# EAGLE design daughter_brd (EAGLE 5.11)
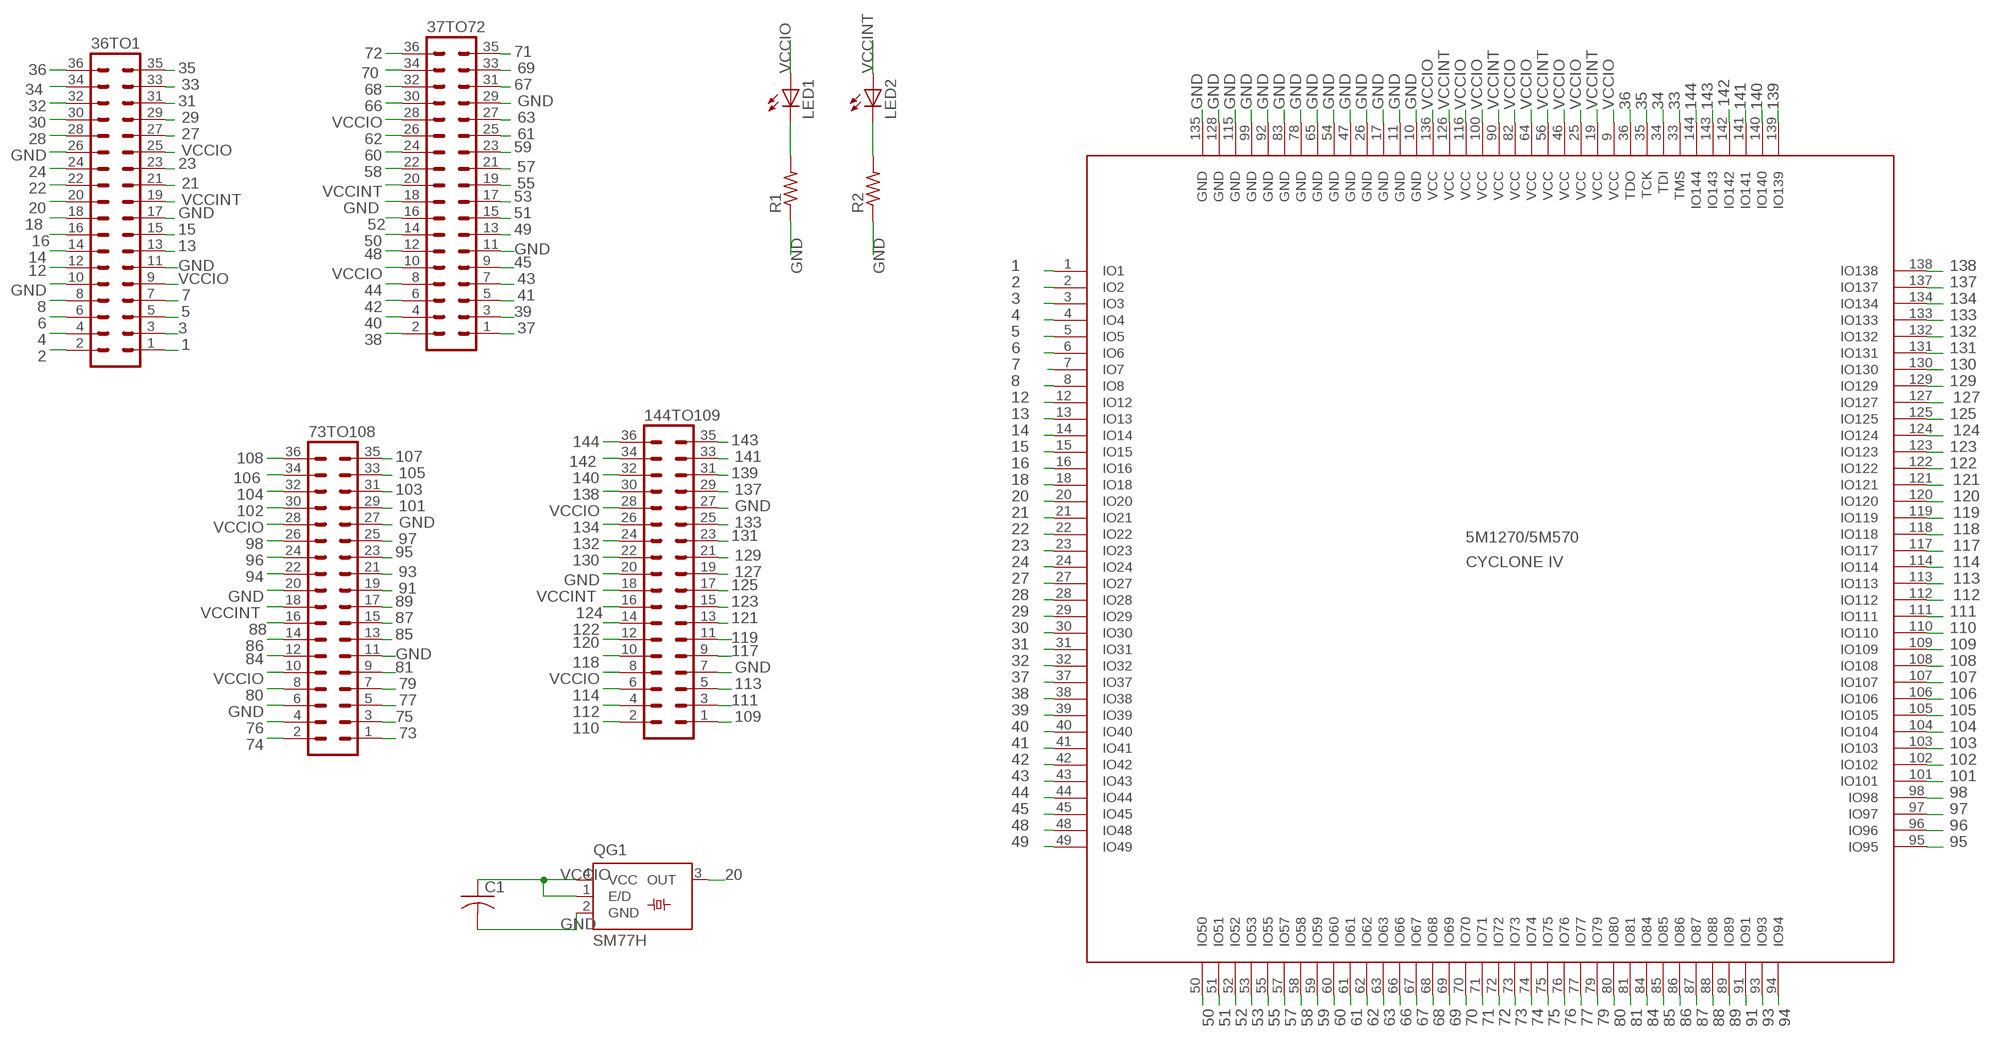
[diagram p0: schematic, sheet 1]

## Parts
5M1270/5M570  CYCLONE IV  IS  [TQFP144]
36TO1  MA18-2  [MA18-2]
37TO72  MA18-2  [MA18-2]
73TO108  MA18-2  [MA18-2]
144TO109  MA18-2  [MA18-2]
C1  C-USC1206  [C1206]
LED1  LEDSMT1206  [1206]
LED2  LEDSMT1206  [1206]
QG1  SM77H  [SM77H]
R1  R-US_M1206  [M1206]
R2  R-US_M1206  [M1206]

## Nets
1: 5M1270/5M570.1(IO1) 36TO1.1
2: 5M1270/5M570.2(IO2) 36TO1.2
3: 5M1270/5M570.3(IO3) 36TO1.3
4: 5M1270/5M570.4(IO4) 36TO1.4
5: 5M1270/5M570.5(IO5) 36TO1.5
6: 5M1270/5M570.6(IO6) 36TO1.6
7: 5M1270/5M570.7(IO7) 36TO1.7
8: 5M1270/5M570.8(IO8) 36TO1.8
12: 5M1270/5M570.12(IO12) 36TO1.12
13: 5M1270/5M570.13(IO13) 36TO1.13
14: 5M1270/5M570.14(IO14) 36TO1.14
15: 5M1270/5M570.15(IO15) 36TO1.15
16: 5M1270/5M570.16(IO16) 36TO1.16
18: 5M1270/5M570.18(IO18) 36TO1.18
20: 5M1270/5M570.20(IO20) 36TO1.20 QG1.3(OUT)
21: 5M1270/5M570.21(IO21) 36TO1.21
22: 5M1270/5M570.22(IO22) 36TO1.22
23: 5M1270/5M570.23(IO23) 36TO1.23
24: 5M1270/5M570.24(IO24) 36TO1.24
27: 5M1270/5M570.27(IO27) 36TO1.27
28: 5M1270/5M570.28(IO28) 36TO1.28
29: 5M1270/5M570.29(IO29) 36TO1.29
30: 5M1270/5M570.30(IO30) 36TO1.30
31: 5M1270/5M570.31(IO31) 36TO1.31
32: 5M1270/5M570.32(IO32) 36TO1.32
33: 5M1270/5M570.33(TMS) 36TO1.33
34: 5M1270/5M570.34(TDI) 36TO1.34
35: 5M1270/5M570.35(TCK) 36TO1.35
36: 5M1270/5M570.36(TDO) 36TO1.36
37: 5M1270/5M570.37(IO37) 37TO72.1
38: 5M1270/5M570.38(IO38) 37TO72.2
39: 5M1270/5M570.39(IO39) 37TO72.3
40: 5M1270/5M570.40(IO40) 37TO72.4
41: 5M1270/5M570.41(IO41) 37TO72.5
42: 5M1270/5M570.42(IO42) 37TO72.6
43: 5M1270/5M570.43(IO43) 37TO72.7
44: 5M1270/5M570.44(IO44) 37TO72.8
45: 5M1270/5M570.45(IO45) 37TO72.9
48: 5M1270/5M570.48(IO48) 37TO72.12
49: 5M1270/5M570.49(IO49) 37TO72.13
50: 5M1270/5M570.50(IO50) 37TO72.14
51: 5M1270/5M570.51(IO51) 37TO72.15
52: 5M1270/5M570.52(IO52) 37TO72.16
53: 5M1270/5M570.53(IO53) 37TO72.17
55: 5M1270/5M570.55(IO55) 37TO72.19
57: 5M1270/5M570.57(IO57) 37TO72.21
58: 5M1270/5M570.58(IO58) 37TO72.22
59: 5M1270/5M570.59(IO59) 37TO72.23
60: 5M1270/5M570.60(IO60) 37TO72.24
61: 5M1270/5M570.61(IO61) 37TO72.25
62: 5M1270/5M570.62(IO62) 37TO72.26
63: 5M1270/5M570.63(IO63) 37TO72.27
66: 5M1270/5M570.66(IO66) 37TO72.30
67: 5M1270/5M570.67(IO67) 37TO72.31
68: 5M1270/5M570.68(IO68) 37TO72.32
69: 5M1270/5M570.69(IO69) 37TO72.33
70: 5M1270/5M570.70(IO70) 37TO72.34
71: 5M1270/5M570.71(IO71) 37TO72.35
72: 5M1270/5M570.72(IO72) 37TO72.36
73: 5M1270/5M570.73(IO73) 73TO108.1
74: 5M1270/5M570.74(IO74) 73TO108.2
75: 5M1270/5M570.75(IO75) 73TO108.3
76: 5M1270/5M570.76(IO76) 73TO108.4
77: 5M1270/5M570.77(IO77) 73TO108.5
79: 5M1270/5M570.79(IO79) 73TO108.7
80: 5M1270/5M570.80(IO80) 73TO108.8
81: 5M1270/5M570.81(IO81) 73TO108.9
84: 5M1270/5M570.84(IO84) 73TO108.12
85: 5M1270/5M570.85(IO85) 73TO108.13
86: 5M1270/5M570.86(IO86) 73TO108.14
87: 5M1270/5M570.87(IO87) 73TO108.15
88: 5M1270/5M570.88(IO88) 73TO108.16
89: 5M1270/5M570.89(IO89) 73TO108.17
91: 5M1270/5M570.91(IO91) 73TO108.19
93: 5M1270/5M570.93(IO93) 73TO108.21
94: 5M1270/5M570.94(IO94) 73TO108.22
95: 5M1270/5M570.95(IO95) 73TO108.23
96: 5M1270/5M570.96(IO96) 73TO108.24
97: 5M1270/5M570.97(IO97) 73TO108.25
98: 5M1270/5M570.98(IO98) 73TO108.26
101: 5M1270/5M570.101(IO101) 73TO108.29
102: 5M1270/5M570.102(IO102) 73TO108.30
103: 5M1270/5M570.103(IO103) 73TO108.31
104: 5M1270/5M570.104(IO104) 73TO108.32
105: 5M1270/5M570.105(IO105) 73TO108.33
106: 5M1270/5M570.106(IO106) 73TO108.34
107: 5M1270/5M570.107(IO107) 73TO108.35
108: 5M1270/5M570.108(IO108) 73TO108.36
109: 5M1270/5M570.109(IO109) 144TO109.1
110: 5M1270/5M570.110(IO110) 144TO109.2
111: 5M1270/5M570.111(IO111) 144TO109.3
112: 5M1270/5M570.112(IO112) 144TO109.4
113: 5M1270/5M570.113(IO113) 144TO109.5
114: 5M1270/5M570.114(IO114) 144TO109.6
117: 5M1270/5M570.117(IO117) 144TO109.9
118: 5M1270/5M570.118(IO118) 144TO109.10
119: 5M1270/5M570.119(IO119) 144TO109.11
120: 5M1270/5M570.120(IO120) 144TO109.12
121: 5M1270/5M570.121(IO121) 144TO109.13
122: 5M1270/5M570.122(IO122) 144TO109.14
123: 5M1270/5M570.123(IO123) 144TO109.15
124: 5M1270/5M570.124(IO124) 144TO109.16
125: 5M1270/5M570.125(IO125) 144TO109.17
127: 5M1270/5M570.127(IO127) 144TO109.19
129: 5M1270/5M570.129(IO129) 144TO109.21
130: 5M1270/5M570.130(IO130) 144TO109.22
131: 5M1270/5M570.131(IO131) 144TO109.23
132: 5M1270/5M570.132(IO132) 144TO109.24
133: 5M1270/5M570.133(IO133) 144TO109.25
134: 5M1270/5M570.134(IO134) 144TO109.26
137: 5M1270/5M570.137(IO137) 144TO109.29
138: 5M1270/5M570.138(IO138) 144TO109.30
139: 5M1270/5M570.139(IO139) 144TO109.31
140: 5M1270/5M570.140(IO140) 144TO109.32
141: 5M1270/5M570.141(IO141) 144TO109.33
142: 5M1270/5M570.142(IO142) 144TO109.34
143: 5M1270/5M570.143(IO143) 144TO109.35
144: 5M1270/5M570.144(IO144) 144TO109.36
GND: 5M1270/5M570.10(GND) 5M1270/5M570.11(GND) 5M1270/5M570.17(GND) 5M1270/5M570.26(GND) 5M1270/5M570.47(GND) 5M1270/5M570.54(GND) 5M1270/5M570.65(GND) 5M1270/5M570.78(GND) 5M1270/5M570.83(GND) 5M1270/5M570.92(GND) 5M1270/5M570.99(GND) 5M1270/5M570.115(GND) 5M1270/5M570.128(GND) 5M1270/5M570.135(GND) 36TO1.10 36TO1.11 36TO1.17 36TO1.26 37TO72.11 37TO72.18 37TO72.29 73TO108.6 73TO108.11 73TO108.20 73TO108.27 144TO109.7 144TO109.20 144TO109.27 C1.2 QG1.2(GND) R1.1 R2.1
N$1: LED1.C R1.2
N$2: LED2.C R2.2
VCCINT: 5M1270/5M570.19(VCC) 5M1270/5M570.56(VCC) 5M1270/5M570.90(VCC) 5M1270/5M570.126(VCC) 36TO1.19 37TO72.20 73TO108.18 144TO109.18 LED2.A
VCCIO: 5M1270/5M570.9(VCC) 5M1270/5M570.25(VCC) 5M1270/5M570.46(VCC) 5M1270/5M570.64(VCC) 5M1270/5M570.82(VCC) 5M1270/5M570.100(VCC) 5M1270/5M570.116(VCC) 5M1270/5M570.136(VCC) 36TO1.9 36TO1.25 37TO72.10 37TO72.28 73TO108.10 73TO108.28 144TO109.8 144TO109.28 C1.1 LED1.A QG1.1(E/D) QG1.4(VCC)

## Library data of the parts
5M1270/5M570 = MAX-V:IS: max5.bsd edit this description Auto generated by make-symbol-device-package-bsdl.ulp Rev. 34 Source: max5.bsd.txt
36TO1 37TO72 73TO108 144TO109 = con-lstb:MA18-2: PIN HEADER; OC_FARNELL: unknown; OC_NEWARK: unknown
C1 = rcl:C-US: CAPACITOR, American symbol
LED1 LED2 = led:LED: LED OSRAM: - CHIPLED LG R971, LG N971, LY N971, LG Q971, LY Q971, LO R971, LY R971 LH N974, LH R974 LS Q976, LO Q976, LY Q976 LO Q996 - Hyper CHIPLED LW Q18S LB Q993, LB Q99A, LB R99A - SideLED LS A670, LO A670, LY A670, LG A670, LP A670 LB A673, LV A673, LT A673, LW A673 LH A674 LY A675 LS A676, LA A676, LO A676, LY A676, LW A676 LS A679, LY A679, LG A679 - Hyper Micro SIDELED® LS Y876, LA Y876, LO Y876, LY Y876 LT Y87S - SmartLED LW L88C, LW L88S LB L89C, LB L89S, LG L890 LS L89K, LO L89K, LY L89K LS L896, LA L896, LO L896, LY L896 - TOPLED LS T670, LO T670, LY T670, LG T670, LP T670 LSG T670, LSP T670, LSY T670, LOP T670, LYG T670 LG T671, LOG T671, LSG T671 LB T673, LV T673, LT T673, LW T673 LH T674 LS T676, LA T676, LO T676, LY T676, LB T676, LH T676, LSB T676, LW T676 LB T67C, LV T67C, LT T67C, LS T67K, LO T67K, LY T67K, LW E67C LS E67B, LA E67B, LO E67B, LY E67B, LB E67C, LV E67C, LT E67C LW T67C LS T679, LY T679, LG T679 LS T770, LO T770, LY T770, LG T770, LP T770 LB T773, LV T773, LT T773, LW T773 LH T774 LS E675, LA E675, LY E675, LS T675 LS T776, LA T776, LO T776, LY T776, LB T776 LHGB T686 LT T68C, LB T68C - Hyper Mini TOPLED® LB M676 - Mini TOPLED Santana® LG M470 LS M47K, LO M47K, LY M47K Source: http://www.osram.convergy.de LUXEON: - LUMILED® LXK2-PW12-R00, LXK2-PW12-S00, LXK2-PW14-U00, LXK2-PW14-V00 LXK2-PM12-R00, LXK2-PM12-S00, LXK2-PM14-U00 LXK2-PE12-Q00, LXK2-PE12-R00, LXK2-PE12-S00, LXK2-PE14-T00, LXK2-PE14-U00 LXK2-PB12-K00, LXK2-PB12-L00, LXK2-PB12-M00, LXK2-PB14-N00, LXK2-PB14-P00, LXK2-PB14-Q00 LXK2-PR12-L00, LXK2-PR12-M00, LXK2-PR14-Q00, LXK2-PR14-R00 LXK2-PD12-Q00, LXK2-PD12-R00, LXK2-PD12-S00 LXK2-PH12-R00, LXK2-PH12-S00 LXK2-PL12-P00, LXK2-PL12-Q00, LXK2-PL12-R00 Source: www.luxeon.com KINGBRIGHT: KA-3528ASYC Source: www.kingbright.com
QG1 = crystal:SM77H: 3.3V CMOS Clock Oscillator Source: www.pletronics.com .. sm77h%203.3v.pdf; OC_FARNELL: unknown; OC_NEWARK: unknown
R1 R2 = resistor:R-US_: RESISTOR, American symbol

## Board
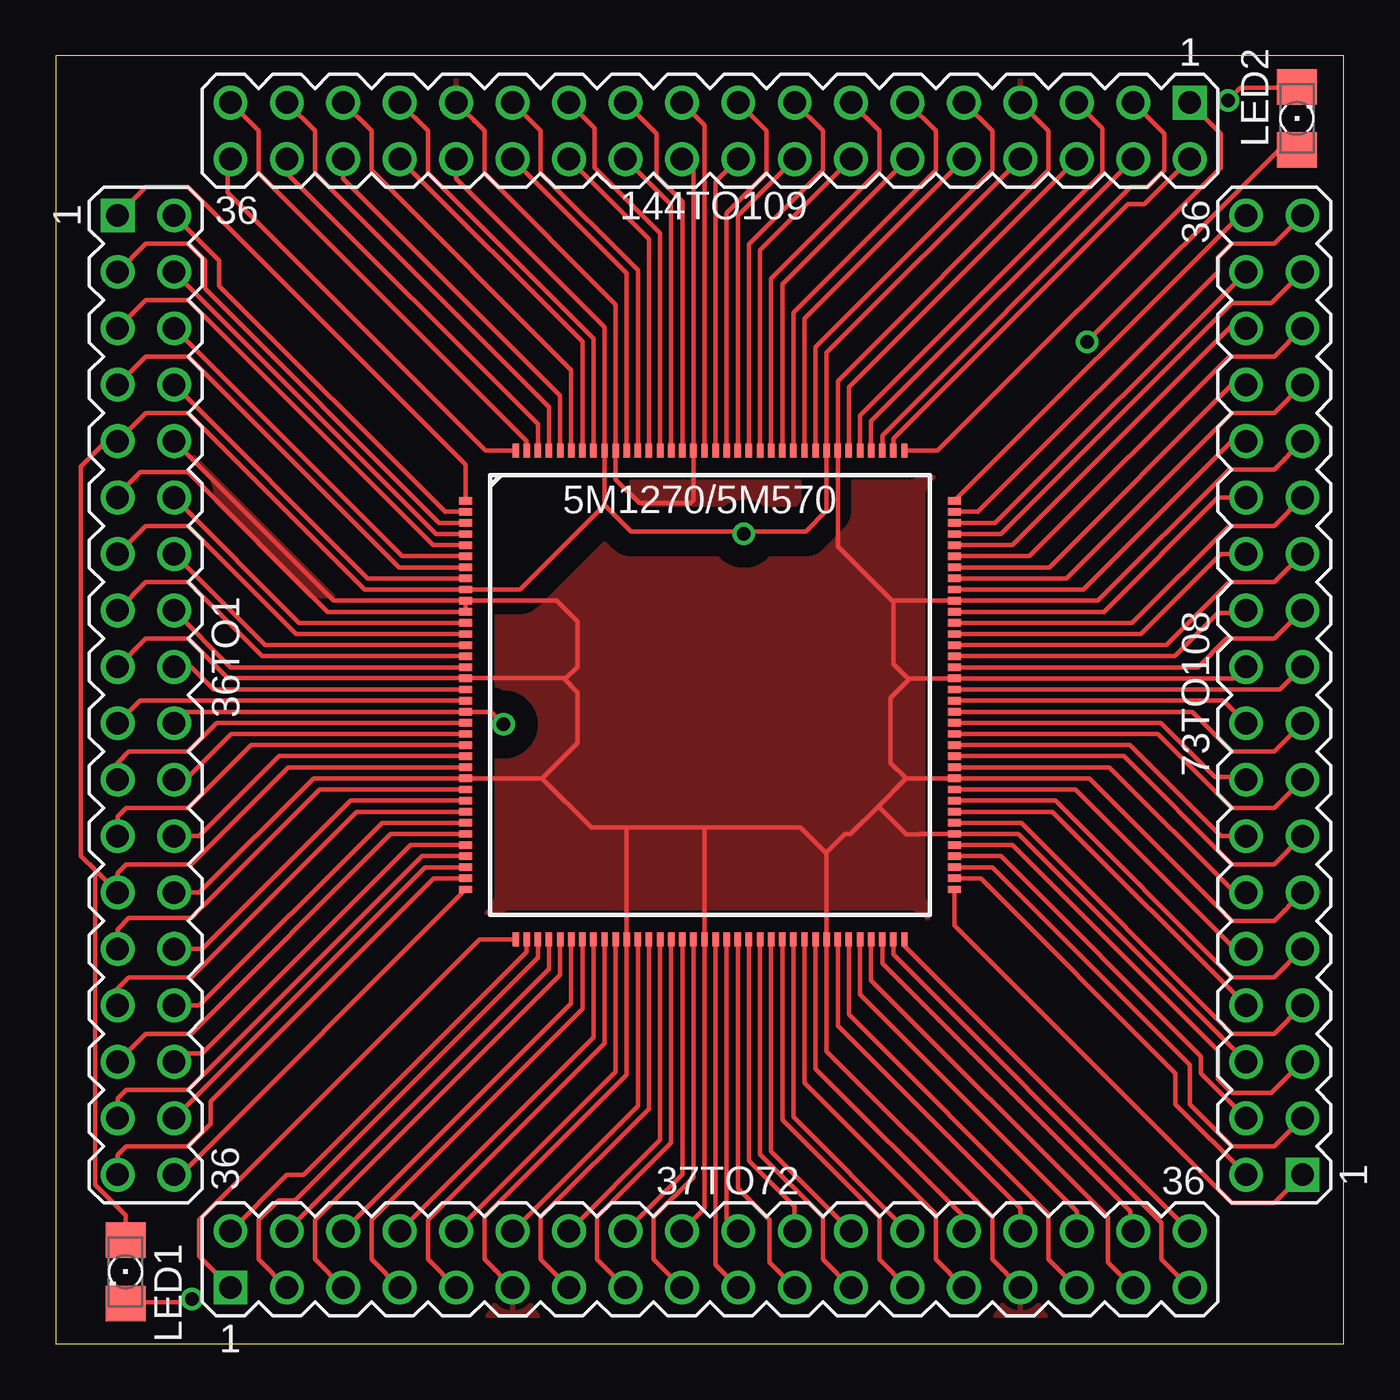
[diagram p1: board, top side]
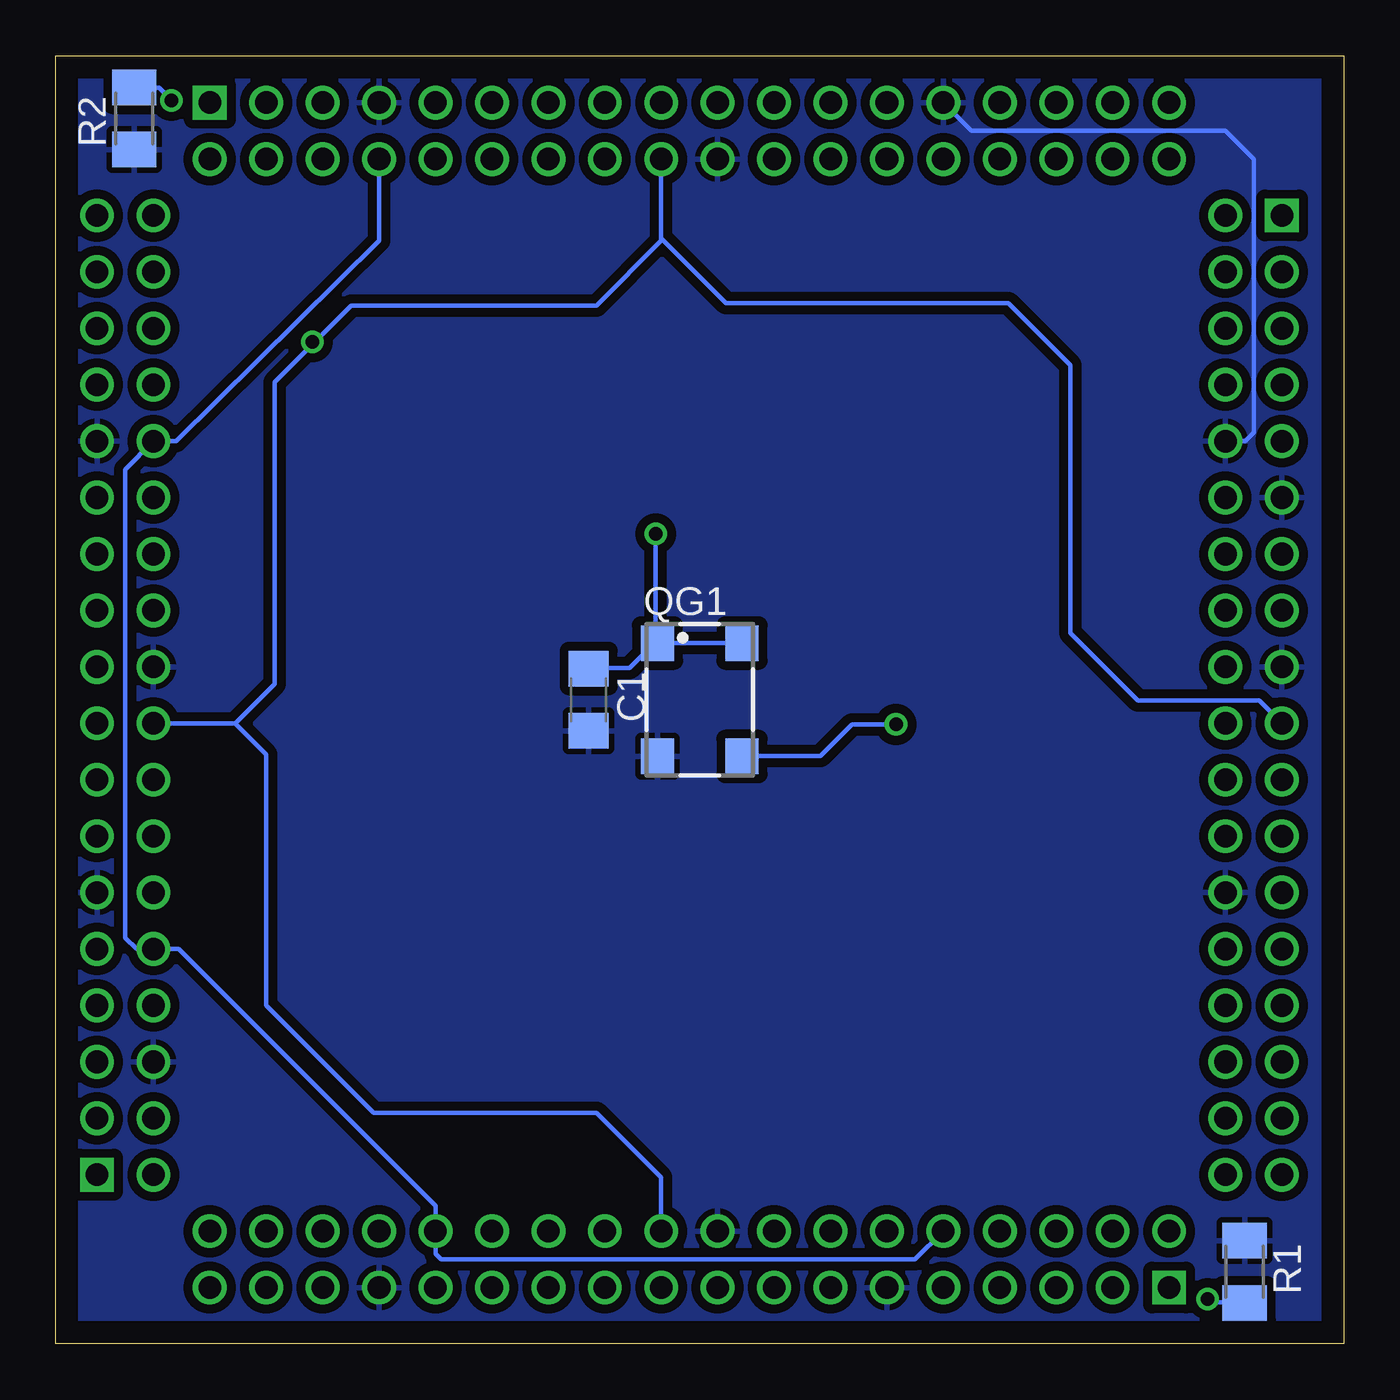
[diagram p2: board, bottom side, seen from below]

Size 58 x 58 mm. Coordinates in mm from the lower left corner, seen from the top.
Outline: 0,0 58,0 58,58 0,58 0,0
Copper layers (1*16): Top 0.035mm / dielectric 1.5mm / Bottom 0.035mm
Design rules "default *": minimum track width 8mil, minimum drill 24mil, track to track 6mil, track to pad 6mil, pad to pad 6mil, via to via 6mil, smd to smd 6mil, copper to edge 40mil, drill to drill 10mil, minimum pad ring 8mil, minimum via ring 8mil, stop-mask expansion 4mil, vias tented up to drill 0mil, thermal gap 10mil

### Footprints (pad centres in the part's own frame; a part is rotated, then mirrored left to right if it is on the bottom)
TQFP144 = smd 0.6 x 0.3: 1 -11,8.75; 2 -11,8.25; 3 -11,7.75; 4 -11,7.25; 5 -11,6.75; 6 -11,6.25; 7 -11,5.75; 8 -11,5.25; 9 -11,4.75; 10 -11,4.25; 11 -11,3.75; 12 -11,3.25; 13 -11,2.75; 14 -11,2.25; 15 -11,1.75; 16 -11,1.25; 17 -11,0.75; 18 -11,0.25; 19 -11,-0.25; 20 -11,-0.75; 21 -11,-1.25; 22 -11,-1.75; 23 -11,-2.25; 24 -11,-2.75; 25 -11,-3.25; 26 -11,-3.75; 27 -11,-4.25; 28 -11,-4.75; 29 -11,-5.25; 30 -11,-5.75; 31 -11,-6.25; 32 -11,-6.75; 33 -11,-7.25; 34 -11,-7.75; 35 -11,-8.25; 36 -11,-8.75; 73 11,-8.75; 74 11,-8.25; 75 11,-7.75; 76 11,-7.25; 77 11,-6.75; 78 11,-6.25; 79 11,-5.75; 80 11,-5.25; 81 11,-4.75; 82 11,-4.25; 83 11,-3.75; 84 11,-3.25; 85 11,-2.75; 86 11,-2.25; 87 11,-1.75; 88 11,-1.25; 89 11,-0.75; 90 11,-0.25; 91 11,0.25; 92 11,0.75; 93 11,1.25; 94 11,1.75; 95 11,2.25; 96 11,2.75; 97 11,3.25; 98 11,3.75; 99 11,4.25; 100 11,4.75; 101 11,5.25; 102 11,5.75; 103 11,6.25; 104 11,6.75; 105 11,7.25; 106 11,7.75; 107 11,8.25; 108 11,8.75 | smd 0.3 x 0.6: 37 -8.75,-11; 38 -8.25,-11; 39 -7.75,-11; 40 -7.25,-11; 41 -6.75,-11; 42 -6.25,-11; 43 -5.75,-11; 44 -5.25,-11; 45 -4.75,-11; 46 -4.25,-11; 47 -3.75,-11; 48 -3.25,-11; 49 -2.75,-11; 50 -2.25,-11; 51 -1.75,-11; 52 -1.25,-11; 53 -0.75,-11; 54 -0.25,-11; 55 0.25,-11; 56 0.75,-11; 57 1.25,-11; 58 1.75,-11; 59 2.25,-11; 60 2.75,-11; 61 3.25,-11; 62 3.75,-11; 63 4.25,-11; 64 4.75,-11; 65 5.25,-11; 66 5.75,-11; 67 6.25,-11; 68 6.75,-11; 69 7.25,-11; 70 7.75,-11; 71 8.25,-11; 72 8.75,-11; 109 8.75,11; 110 8.25,11; 111 7.75,11; 112 7.25,11; 113 6.75,11; 114 6.25,11; 115 5.75,11; 116 5.25,11; 117 4.75,11; 118 4.25,11; 119 3.75,11; 120 3.25,11; 121 2.75,11; 122 2.25,11; 123 1.75,11; 124 1.25,11; 125 0.75,11; 126 0.25,11; 127 -0.25,11; 128 -0.75,11; 129 -1.25,11; 130 -1.75,11; 131 -2.25,11; 132 -2.75,11; 133 -3.25,11; 134 -3.75,11; 135 -4.25,11; 136 -4.75,11; 137 -5.25,11; 138 -5.75,11; 139 -6.25,11; 140 -6.75,11; 141 -7.25,11; 142 -7.75,11; 143 -8.25,11; 144 -8.75,11
MA18-2 = drill 1.016 square: 1 -21.59,-1.27 | drill 1.016 round: 2 -21.59,1.27; 3 -19.05,-1.27; 4 -19.05,1.27; 5 -16.51,-1.27; 6 -16.51,1.27; 7 -13.97,-1.27; 8 -13.97,1.27; 9 -11.43,-1.27; 10 -11.43,1.27; 11 -8.89,-1.27; 12 -8.89,1.27; 13 -6.35,-1.27; 14 -6.35,1.27; 15 -3.81,-1.27; 16 -3.81,1.27; 17 -1.27,-1.27; 18 -1.27,1.27; 19 1.27,-1.27; 20 1.27,1.27; 21 3.81,-1.27; 22 3.81,1.27; 23 6.35,-1.27; 24 6.35,1.27; 25 8.89,-1.27; 26 8.89,1.27; 27 11.43,-1.27; 28 11.43,1.27; 29 13.97,-1.27; 30 13.97,1.27; 31 16.51,-1.27; 32 16.51,1.27; 33 19.05,-1.27; 34 19.05,1.27; 35 21.59,-1.27; 36 21.59,1.27
C1206 = smd 1.6 x 1.8: 1 -1.4,0; 2 1.4,0
1206 = smd 1.6 x 1.803: A -1.422,0; C 1.422,0
SM77H = smd 1.6 x 1.5: 1 -2.55,-1.9; 2 2.55,-1.9; 3 2.55,1.9; 4 -2.55,1.9
M1206 = smd 1.6 x 2: 1 -1.4,0; 2 1.4,0

### Placement (x,y rotation side)
5M1270/5M570  29.46,29.21 0 top
36TO1  4.06,29.21 270 top
37TO72  29.46,3.81 0 top
73TO108  54.86,29.21 90 top
144TO109  29.46,54.61 180 top
C1  34,29 270 bottom
LED1  3.15,3.25 270 top
LED2  55.88,55.17 90 top
QG1  29,29 270 bottom
R1  4.47,3.25 270 bottom
R2  54.46,55.17 90 bottom

### Tracks (layer width: path | path; a pad name or v marks a point on that pad's centre or on a via)
1
  Top 0.203: 5M1270/5M570.1 18.46,39.58 5.97,52.07 4.06,52.07 36TO1.1
2
  Top 0.203: 5M1270/5M570.2 17.53,37.46 7.37,47.62 7.37,48.77 36TO1.2
3
  Top 0.203: 5M1270/5M570.3 17.27,36.96 6.73,47.5 6.73,48.77 5.97,49.53 4.06,49.53 36TO1.3
4
  Top 0.203: 5M1270/5M570.4 17.13,36.46 36TO1.4
5
  Top 0.203: 5M1270/5M570.5 17,35.96 5.97,46.99 4.06,46.99 36TO1.5
6
  Top 0.203: 5M1270/5M570.6 15.59,35.46 36TO1.6
7
  Top 0.203: 5M1270/5M570.7 15.46,34.96 5.97,44.45 4.06,44.45 36TO1.7
8
  Top 0.203: 5M1270/5M570.8 14.05,34.46 36TO1.8
12
  Top 0.203: 5M1270/5M570.12 10.97,32.46 36TO1.12
13
  Top 0.203: 5M1270/5M570.13 10.84,31.96 5.97,36.83 4.06,36.83 36TO1.13
14
  Top 0.203: 5M1270/5M570.14 9.43,31.46 36TO1.14
15
  Top 0.203: 5M1270/5M570.15 9.3,30.96 5.97,34.29 4.06,34.29 36TO1.15
16
  Top 0.203: 5M1270/5M570.16 7.89,30.46 36TO1.16
18
  Top 0.203: 36TO1.18 6.1,30.48 7.11,29.46 5M1270/5M570.18
20  (via drill 0.61)
  Top 0.203: 36TO1.20 5.85,28.46 5M1270/5M570.20 19.6,28.46 v20.17,27.89
  Bottom 0.203: QG1.3 27.08,26.47 23.57,26.47 22.15,27.89 v20.17,27.89
21
  Top 0.203: 5M1270/5M570.21 7.26,27.96 5.97,26.67 3.3,26.67 2.79,26.16 36TO1.21
22
  Top 0.203: 5M1270/5M570.22 7.9,27.46 5.84,25.4 36TO1.22
23
  Top 0.203: 5M1270/5M570.23 8.8,26.96 5.97,24.13 3.17,24.13 2.79,23.75 36TO1.23
24
  Top 0.203: 5M1270/5M570.24 10.08,26.46 6.48,22.86 36TO1.24
27
  Top 0.203: 5M1270/5M570.27 11.88,24.96 6.1,19.18 3.3,19.18 2.79,18.67 36TO1.27
28
  Top 0.203: 5M1270/5M570.28 13.28,24.46 6.6,17.78 36TO1.28
29
  Top 0.203: 5M1270/5M570.29 13.55,23.96 6.1,16.51 3.3,16.51 2.79,16 36TO1.29
30
  Top 0.203: 5M1270/5M570.30 14.7,23.46 6.48,15.24 36TO1.30
31
  Top 0.203: 5M1270/5M570.31 15.09,22.96 6.1,13.97 4.06,13.97 36TO1.31
32
  Top 0.203: 5M1270/5M570.32 15.98,22.46 6.6,13.08 5.71,13.08 36TO1.32
33
  Top 0.203: 5M1270/5M570.33 16.5,21.96 5.97,11.43 3.17,11.43 2.79,11.05 36TO1.33
34
  Top 0.203: 5M1270/5M570.34 16.63,21.46 36TO1.34
35
  Top 0.203: 5M1270/5M570.35 17.02,20.96 6.99,10.92 6.99,9.91 5.97,8.89 3.17,8.89 2.79,8.51 36TO1.35
36
  Top 0.203: 36TO1.36 5.62,7.62 5M1270/5M570.36
37
  Top 0.203: 5M1270/5M570.37 19.1,18.21 6.48,5.59 6.48,3.94 37TO72.1
38
  Top 0.203: 5M1270/5M570.38 21.21,17.66 11.18,7.62 10.41,7.62 37TO72.2
39
  Top 0.203: 5M1270/5M570.39 21.71,17.4 10.79,6.48 10.03,6.48 9.14,5.59 9.14,3.81 37TO72.3
40
  Top 0.203: 5M1270/5M570.40 22.21,16.88 37TO72.4
41
  Top 0.203: 5M1270/5M570.41 22.71,16.62 11.68,5.59 11.68,3.81 37TO72.5
42
  Top 0.203: 5M1270/5M570.42 23.21,15.34 37TO72.6
43
  Top 0.203: 5M1270/5M570.43 23.71,15.08 14.22,5.59 14.22,3.81 37TO72.7
44
  Top 0.203: 5M1270/5M570.44 24.21,13.8 37TO72.8
45
  Top 0.203: 5M1270/5M570.45 24.71,13.54 16.76,5.59 16.76,3.81 37TO72.9
48
  Top 0.203: 5M1270/5M570.48 26.21,10.72 37TO72.12
49
  Top 0.203: 5M1270/5M570.49 26.71,10.59 21.84,5.71 21.84,3.81 37TO72.13
50
  Top 0.203: 5M1270/5M570.50 27.21,9.18 37TO72.14
51
  Top 0.203: 5M1270/5M570.51 27.71,9.04 24.38,5.71 24.38,3.81 37TO72.15
52
  Top 0.203: 5M1270/5M570.52 28.21,7.64 37TO72.16
53
  Top 0.203: 5M1270/5M570.53 28.71,7.5 26.92,5.71 26.92,3.81 37TO72.17
55
  Top 0.203: 5M1270/5M570.55 29.71,3.56 37TO72.19
57
  Top 0.203: 5M1270/5M570.57 30.71,7 32.13,5.59 32.13,3.68 37TO72.21
58
  Top 0.203: 5M1270/5M570.58 31.21,8.26 33.27,6.2 37TO72.22
59
  Top 0.203: 5M1270/5M570.59 31.71,8.54 34.54,5.71 34.54,3.81 37TO72.23
60
  Top 0.203: 5M1270/5M570.60 32.21,8.68 37TO72.24
61
  Top 0.203: 5M1270/5M570.61 32.71,10.09 37.08,5.71 37.08,3.81 37TO72.25
62
  Top 0.203: 5M1270/5M570.62 33.21,10.22 37TO72.26
63
  Top 0.203: 5M1270/5M570.63 33.71,11.75 39.62,5.84 39.62,3.81 37TO72.27
66
  Top 0.203: 5M1270/5M570.66 35.21,14.32 43.43,6.1 37TO72.30
67
  Top 0.203: 5M1270/5M570.67 35.71,14.83 44.7,5.84 44.7,3.81 37TO72.31
68
  Top 0.203: 5M1270/5M570.68 36.21,15.73 45.97,5.97 37TO72.32
69
  Top 0.203: 5M1270/5M570.69 36.71,16.37 47.37,5.71 47.37,3.68 37TO72.33
70
  Top 0.203: 5M1270/5M570.70 37.21,17.14 48.39,5.97 48.39,5.21 37TO72.34
71
  Top 0.203: 5M1270/5M570.71 37.71,17.53 49.78,5.46 49.78,3.81 37TO72.35
72
  Top 0.203: 5M1270/5M570.72 38.21,17.92 37TO72.36
73
  Top 0.203: 5M1270/5M570.73 40.46,18.84 52.96,6.35 54.86,6.35 73TO108.1
74
  Top 0.203: 5M1270/5M570.74 41.65,20.96 50.42,12.19 50.42,10.79 73TO108.2
75
  Top 0.203: 5M1270/5M570.75 42.17,21.46 51.05,12.57 51.05,10.79 52.96,8.89 54.86,8.89 73TO108.3
76
  Top 0.203: 5M1270/5M570.76 42.56,21.96 51.56,12.95 51.56,12.19 73TO108.4
77
  Top 0.203: 5M1270/5M570.77 43.07,22.46 52.32,13.21 52.32,11.94 52.96,11.3 54.74,11.3 73TO108.5
79
  Top 0.203: 5M1270/5M570.79 43.47,23.46 52.96,13.97 54.86,13.97 73TO108.7
80
  Top 0.203: 5M1270/5M570.80 44.87,23.96 73TO108.8
81
  Top 0.203: 5M1270/5M570.81 45.01,24.46 52.96,16.51 54.86,16.51 73TO108.9
84
  Top 0.203: 5M1270/5M570.84 47.45,25.96 53.09,20.32 73TO108.12
85
  Top 0.203: 5M1270/5M570.85 48.09,26.46 52.96,21.59 54.86,21.59 73TO108.13
86
  Top 0.203: 5M1270/5M570.86 48.35,26.96 52.45,22.86 73TO108.14
87
  Top 0.203: 5M1270/5M570.87 49.63,27.46 52.96,24.13 54.86,24.13 73TO108.15
88
  Top 0.203: 5M1270/5M570.88 49.76,27.96 52.2,25.53 53.47,25.53 73TO108.16
89
  Top 0.203: 5M1270/5M570.89 51.17,28.46 52.96,26.67 54.86,26.67 73TO108.17
91
  Top 0.203: 5M1270/5M570.91 55.11,29.46 73TO108.19
93
  Top 0.203: 5M1270/5M570.93 51.41,30.46 52.7,31.75 54.86,31.75 73TO108.21
94
  Top 0.203: 5M1270/5M570.94 50.39,30.96 52.32,32.89 53.47,32.89 73TO108.22
95
  Top 0.203: 5M1270/5M570.95 50,31.46 52.83,34.29 54.86,34.29 73TO108.23
96
  Top 0.203: 5M1270/5M570.96 48.85,31.96 52.45,35.56 73TO108.24
97
  Top 0.203: 5M1270/5M570.97 48.46,32.46 52.83,36.83 54.86,36.83 73TO108.25
98
  Top 0.203: 5M1270/5M570.98 47.18,32.96 52.32,38.1 73TO108.26
101
  Top 0.203: 5M1270/5M570.101 45.51,34.46 52.96,41.91 54.86,41.91 73TO108.29
102
  Top 0.203: 5M1270/5M570.102 44.74,34.96 52.96,43.18 73TO108.30
103
  Top 0.203: 5M1270/5M570.103 43.84,35.46 52.83,44.45 54.86,44.45 73TO108.31
104
  Top 0.203: 5M1270/5M570.104 43.07,35.96 52.96,45.85 53.47,45.85 73TO108.32
105
  Top 0.203: 5M1270/5M570.105 42.56,36.46 52.96,46.86 54.74,46.86 73TO108.33
106
  Top 0.203: 5M1270/5M570.106 42.29,36.96 73TO108.34
107
  Top 0.203: 5M1270/5M570.107 41.52,37.46 52.32,48.26 52.32,48.9 52.96,49.53 54.86,49.53 73TO108.35
108
  Top 0.203: 73TO108.36 53.3,50.8 5M1270/5M570.108
109
  Top 0.203: 5M1270/5M570.109 39.7,40.21 52.45,52.96 52.45,54.48 144TO109.1
110
  Top 0.203: 5M1270/5M570.110 37.71,40.76 48.26,51.31 49.02,51.31 144TO109.2
111
  Top 0.203: 5M1270/5M570.111 37.21,40.9 48.39,52.07 49.15,52.07 49.91,52.83 49.91,54.48 144TO109.3
112
  Top 0.203: 5M1270/5M570.112 36.71,41.54 144TO109.4
113
  Top 0.203: 5M1270/5M570.113 36.21,41.8 47.12,52.7 47.12,54.74 144TO109.5
114
  Top 0.203: 5M1270/5M570.114 35.71,43.08 144TO109.6
117
  Top 0.203: 5M1270/5M570.117 34.21,44.88 42.16,52.83 42.16,54.61 144TO109.9
118
  Top 0.203: 5M1270/5M570.118 33.71,46.16 144TO109.10
119
  Top 0.203: 5M1270/5M570.119 33.21,46.42 39.62,52.83 39.62,54.61 144TO109.11
120
  Top 0.203: 5M1270/5M570.120 32.71,47.7 144TO109.12
121
  Top 0.203: 5M1270/5M570.121 32.21,47.96 37.08,52.83 37.08,54.61 144TO109.13
122
  Top 0.203: 5M1270/5M570.122 31.71,49.24 144TO109.14
123
  Top 0.203: 5M1270/5M570.123 31.21,49.5 34.54,52.83 34.54,54.61 144TO109.15
124
  Top 0.203: 5M1270/5M570.124 30.71,50.78 144TO109.16
125
  Top 0.203: 5M1270/5M570.125 30.21,50.91 32,52.7 32,54.61 144TO109.17
127
  Top 0.203: 5M1270/5M570.127 29.21,54.86 144TO109.19
129
  Top 0.203: 5M1270/5M570.129 28.21,51.41 27.05,52.58 27.05,54.48 144TO109.21
130
  Top 0.203: 5M1270/5M570.130 27.71,51.28 144TO109.22
131
  Top 0.203: 5M1270/5M570.131 27.21,50 24.26,52.96 24.26,54.74 144TO109.23
132
  Top 0.203: 5M1270/5M570.132 26.71,49.74 144TO109.24
133
  Top 0.203: 5M1270/5M570.133 26.21,48.34 21.84,52.7 21.84,54.61 144TO109.25
134
  Top 0.203: 5M1270/5M570.134 25.71,48.2 144TO109.26
137
  Top 0.203: 5M1270/5M570.137 24.21,45.26 16.76,52.7 16.76,54.61 144TO109.29
138
  Top 0.203: 5M1270/5M570.138 23.71,45.12 144TO109.30
139
  Top 0.203: 5M1270/5M570.139 23.21,43.84 14.22,52.83 14.22,54.61 144TO109.31
140
  Top 0.203: 5M1270/5M570.140 22.71,42.69 12.95,52.45 144TO109.32
141
  Top 0.203: 5M1270/5M570.141 22.21,42.17 11.68,52.7 11.68,54.61 144TO109.33
142
  Top 0.203: 144TO109.34 10.41,52.7 21.72,41.4 5M1270/5M570.142
143
  Top 0.203: 5M1270/5M570.143 21.21,40.63 9.14,52.7 9.14,54.61 144TO109.35
144
  Top 0.203: 5M1270/5M570.144 19.35,40.21 7.75,51.82 7.75,53.21 144TO109.36
GND
  Top 0.203: 144TO109.27 19.3,54.61 19.3,52.7 25.21,46.8 5M1270/5M570.135 25.21,38.92 26.29,37.85 28.57,37.85 28.71,37.98 5M1270/5M570.128 28.71,52.82 144TO109.20 | 144TO109.7 44.7,54.61 44.7,52.83 35.21,43.34 5M1270/5M570.115 35.21,35.91 37.66,33.46 | 73TO108.27 54.86,39.37 52.83,39.37 46.92,33.46 5M1270/5M570.99 37.66,33.46 | 5M1270/5M570.92 53.07,29.96 73TO108.20 | 5M1270/5M570.83 46.55,25.46 52.96,19.05 54.86,19.05 73TO108.11 | 37TO72.29 42.16,3.81 42.16,5.71 34.71,13.16 5M1270/5M570.65 34.71,22.05 34.67,22.1 | 37TO72.18 29.21,6.1 5M1270/5M570.54 29.21,23.24 | 37TO72.11 19.3,3.81 19.3,5.71 25.71,12.12 5M1270/5M570.47 25.71,23.18 25.65,23.24 | 36TO1.26 6.48,20.32 11.62,25.46 5M1270/5M570.26 21.9,25.46 | 36TO1.17 4.06,31.75 5.97,31.75 7.75,29.97 18.45,29.97 5M1270/5M570.17 18.48,29.97 22.86,29.97 | 5M1270/5M570.10 12.51,33.46 36TO1.10 | 5M1270/5M570.92 38.37,29.96 37.72,30.61 37.72,33.4 37.66,33.46 | 21.9,25.46 23.5,27.05 23.5,29.34 22.86,29.97 | 34.67,22.1 33.53,23.24 29.21,23.24 | 25.65,23.24 29.21,23.24 | 25.65,23.24 24.12,23.24 21.9,25.46 | 34.67,22.1 35.53,22.96 35.79,22.96 37.03,24.21 | 5M1270/5M570.92 38.47,29.96 37.59,29.08 37.59,26.16 38.29,25.46 5M1270/5M570.83 | 5M1270/5M570.83 38.29,25.46 37.03,24.21 | 5M1270/5M570.10 22.55,33.46 23.5,32.51 23.5,30.48 22.99,29.97 22.86,29.97 | 5M1270/5M570.10 5M1270/5M570.11 12.25,32.96 5.97,39.24 3.81,39.24 2.79,38.23 36TO1.11 | 37.03,24.21 38.3,22.94 38.84,22.94 38.86,22.96 5M1270/5M570.78 43.33,22.96 73TO108.6
  Bottom 0.203: 144TO109.27 16.76,54.61 5.33,54.61 4.06,53.34 4.06,41.02 4.45,40.64 36TO1.10
  pour Top (isolate 1.016): 1.4,57.02 56.9,57.02 56.9,1.27 1.4,1.27
  pour Bottom (isolate 0.406): 0.51,57.78 57.66,57.78 57.66,0.51 0.51,0.51
N$1  (via drill 0.61)
  Top 0.203: v6.15,2.03 5.99,1.88 3.15,1.88 LED1.C
  Bottom 0.203: v6.15,2.03 5.99,1.88 4.47,1.88 R1.2
N$2  (via drill 0.61)
  Top 0.203: v52.78,55.98 53.34,56.54 55.88,56.54 LED2.C
  Bottom 0.203: v52.78,55.98 53.34,56.54 54.46,56.54 R2.2
VCCINT  (via drill 0.61)
  Top 0.203: 5M1270/5M570.19 3.81,28.96 36TO1.19 | 5M1270/5M570.90 52.57,28.96 73TO108.18 | 5M1270/5M570.126 29.71,52.32 144TO109.18 | 30.21,9.64 5M1270/5M570.56 30.21,5.6 37TO72.20 | v46.43,45.11 55.07,53.75 LED2.A
  Bottom 0.203: 30.73,49.78 30.73,49.66 33.66,46.74 44.7,46.74 46.38,45.06 | 46.38,45.06 48.13,43.31 48.13,29.72 49.91,27.94 | 49.91,27.94 73TO108.18 | 30.73,49.78 27.81,46.86 15.11,46.86 12.32,44.07 12.32,32 9.27,28.96 3.81,28.96 36TO1.19 | 37TO72.20 30.73,7.49 33.66,10.41 43.69,10.41 48.51,15.24 48.51,26.54 49.91,27.94 | 30.73,49.78 144TO109.18 | 46.38,45.06 v46.43,45.11
VCCIO  (via drill 0.61)
  Top 0.203: 5M1270/5M570.25 10.47,25.96 6.1,21.59 3.17,21.59 2.79,21.21 36TO1.25 1.83,21.29 | 5M1270/5M570.46 25.21,12.26 37TO72.10 | 5M1270/5M570.64 34.21,12.39 40.89,5.71 37TO72.28 | 5M1270/5M570.82 45.91,24.96 53.09,17.78 73TO108.10 | 5M1270/5M570.100 46.28,33.96 52.96,40.64 73TO108.28 | 144TO109.8 34.71,44.62 5M1270/5M570.116 34.71,37.51 33.78,36.58 30.99,36.58 | 144TO109.28 18.03,52.45 24.71,45.77 5M1270/5M570.136 24.71,37.77 | 30.99,36.58 25.91,36.58 24.71,37.77 | 1.83,21.29 1.14,21.97 1.14,39.5 2.29,40.64 36TO1.9 4.06,41.91 5.97,41.91 13.92,33.96 5M1270/5M570.9 20.9,33.96 24.71,37.77 | 30.99,36.58 v30.99,36.47 | LED1.A 3.15,5.79 1.78,7.16 1.78,21.23 1.83,21.29
  Bottom 0.203: 144TO109.8 43.43,49.66 52.58,40.64 73TO108.28 54.86,39.37 54.86,18.29 54.36,17.78 73TO108.10 52.45,17.78 40.89,6.22 37TO72.28 40.89,4.06 40.64,3.81 19.3,3.81 37TO72.10 | QG1.4 27.13,31.55 30.89,31.55 QG1.1 | C1.1 33.98,30.43 32.16,30.43 30.99,31.6 QG1.1 | v30.99,36.47 30.99,31.7 QG1.1